# EAGLE design SolarRS485-V2.0 (EAGLE 7.4.0)
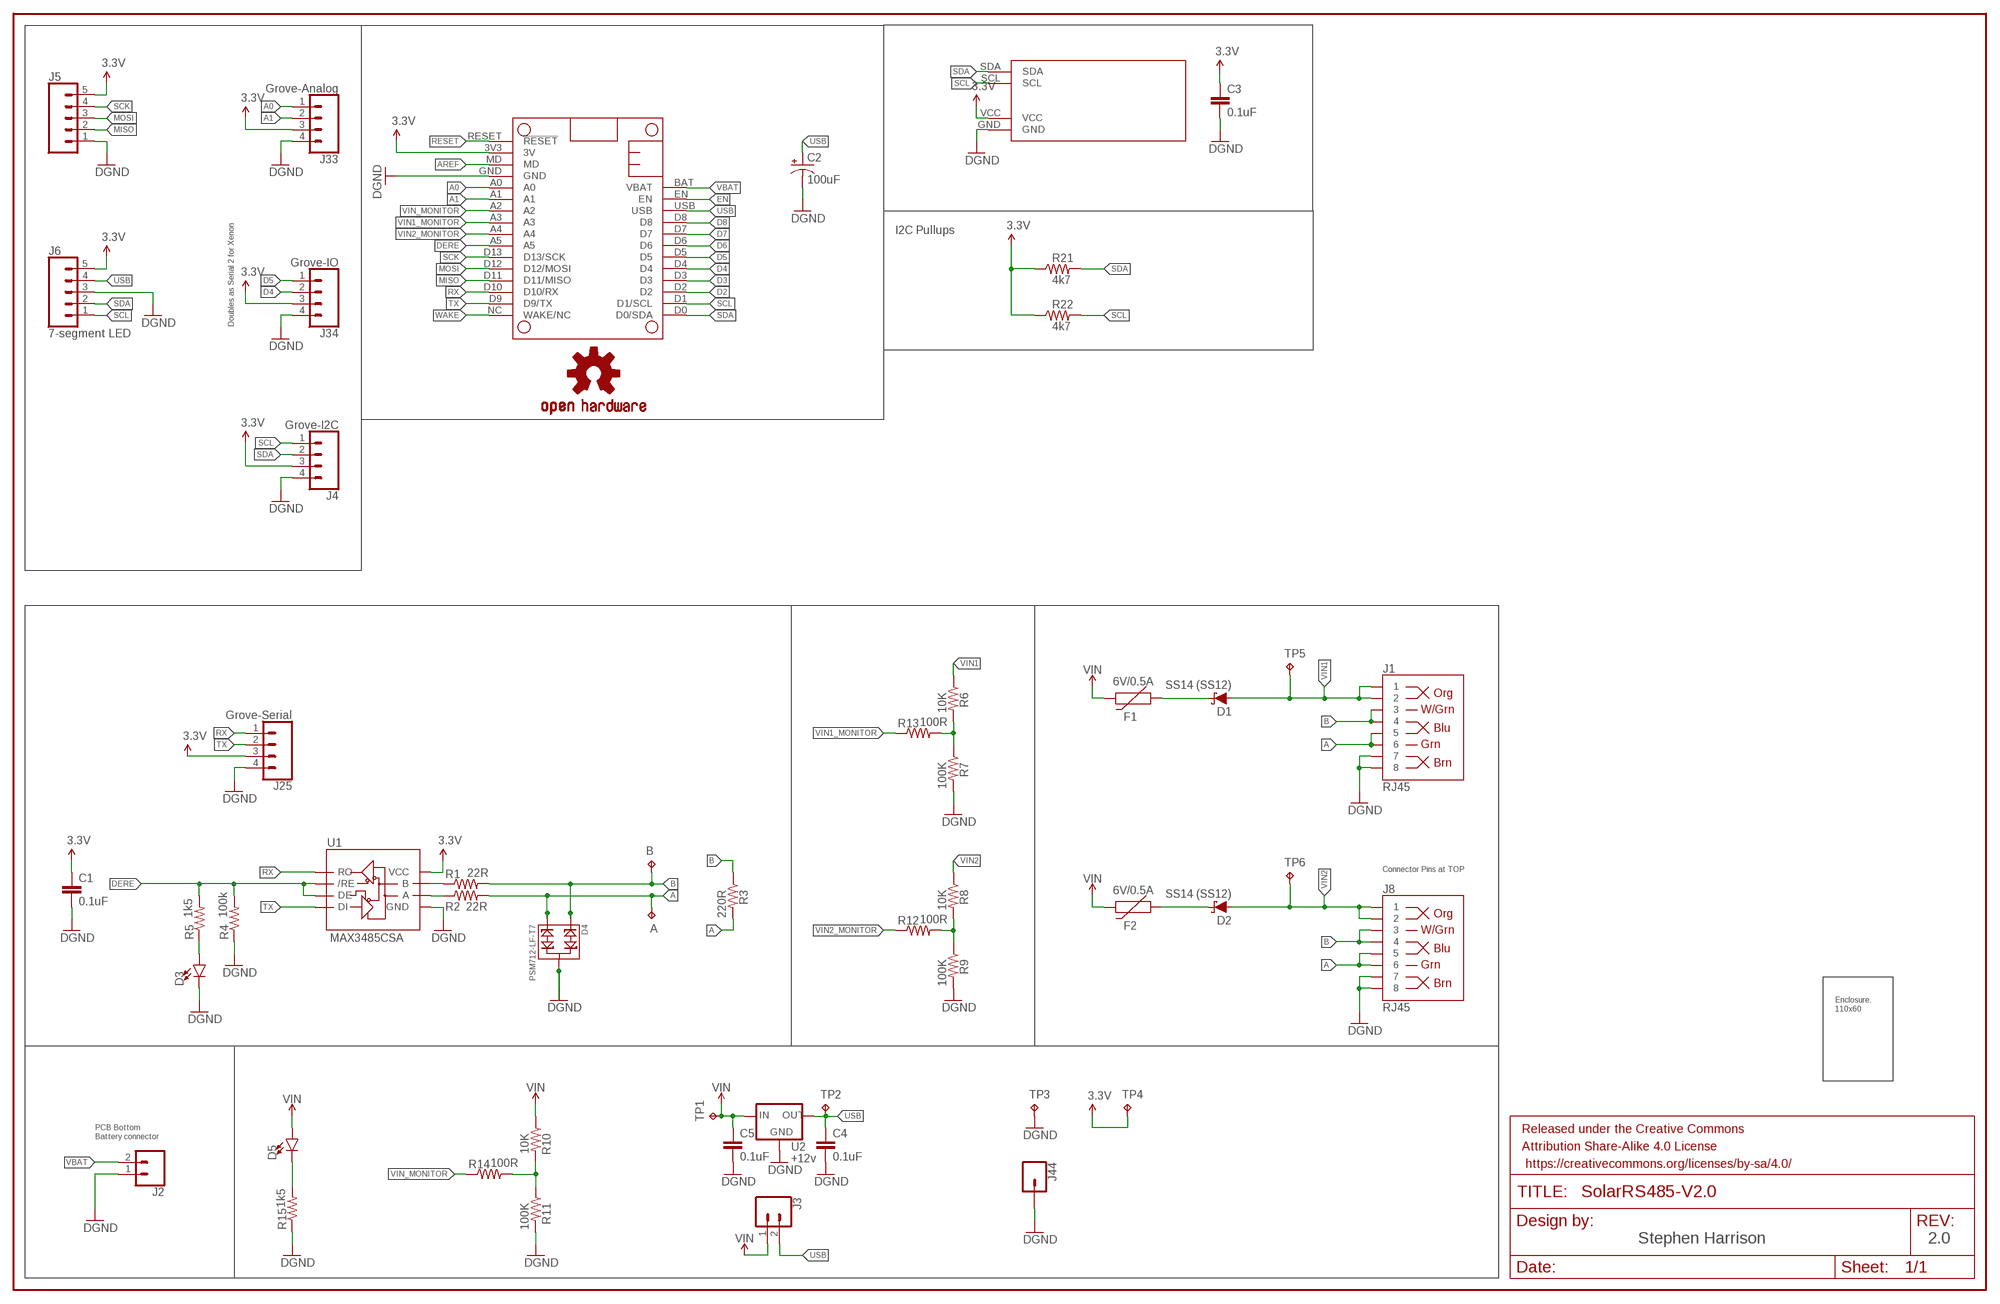
[diagram p0: schematic, sheet 1]

## Parts
A  TPTP15R  [TP15R]
B  TPTP15R  [TP15R]
C1  0.1uF  0.1UF-0805-25V  [0805]
C2  100uF  100UF-POLAR-RADIAL-2.5MM-25V-20%  [CPOL-RADIAL-2.5MM-6.5MM]
C3  0.1uF  0.1UF-0805-25V  [0805]
C4  0.1uF  0.1UF-0805-25V  [0805]
C5  0.1uF  0.1UF-0805-25V  [0805]
D1  SS14 (SS12)  DIODE-SCHOTTKY-SS14  [SMA-DIODE]
D2  SS14 (SS12)  DIODE-SCHOTTKY-SS14  [SMA-DIODE]
D3  LEDLED-1206-BOTTOM-2.0MM-BLUE  [LED-1206-BOTTOM-2.0MM]
D4  PSM712-LF-T7  SMD-DIODE-TVS-5V-225MW(SOT-23)  [SOT-23]
D5  LED1206  [LED-1206]
F1  6V/0.5A  PPTC_HALF-AMP  [1206]
F2  6V/0.5A  PPTC_HALF-AMP  [1206]
FRAME2  FRAME-LEDGER  [CREATIVE_COMMONS]
J1  RJ45  RJ45-8  [RJ45-8]
J2  CONN_02-JST-2MM-SMT  [JST-2-SMD]
J3  CONN_02  [1X02]
J4  Grove-I2C  CONN_04GROVE-JST-PH-4-2MM  [JST-4-PH-GROVE]
J5  CONN_05  [1X05]
J6  7-segment LED  CONN_05  [1X05]
J8  RJ45  RJ45-8  [RJ45-8]
J25  Grove-Serial  CONN_04GROVE-JST-PH-4-2MM  [JST-4-PH-GROVE]
J33  Grove-Analog  CONN_04GROVE-JST-PH-4-2MM  [JST-4-PH-GROVE]
J34  Grove-IO  CONN_04GROVE-JST-PH-4-2MM  [JST-4-PH-GROVE]
J44  CONN_01PTH_NO_SILK_YES_STOP  [1X01_NO_SILK]
LOGO1  OSHW-LOGOM  [OSHW-LOGO-M]
MS1  XENONA  [XENON_BREAKOUT_A]
R1  22R  RESISTOR0805  [0805]
R2  22R  RESISTOR0805  [0805]
R3  220R  RESISTOR0805  [0805]
R4  100k  RESISTOR0805  [0805]
R5  1k5  RESISTOR0805  [0805]
R6  10K  RESISTOR0805  [0805]
R7  100K  RESISTOR0805  [0805]
R8  10K  RESISTOR0805  [0805]
R9  100K  RESISTOR0805  [0805]
R10  10K  RESISTOR0805  [0805]
R11  100K  RESISTOR0805  [0805]
R12  100R  RESISTOR0805  [0805]
R13  100R  RESISTOR0805  [0805]
R14  100R  RESISTOR0805  [0805]
R15  1k5  RESISTOR0805  [0805]
R21  4k7  RESISTOR0805  [0805]
R22  4k7  RESISTOR0805  [0805]
TP1  TPTP15R  [TP15R]
TP2  TPTP15R  [TP15R]
TP3  TPTP15R  [TP15R]
TP4  TPTP15R  [TP15R]
TP5  TPTP15R  [TP15R]
TP6  TPTP15R  [TP15R]
U1  MAX3485CSA  RS485SOIC  [SO08]
U2  +12v  V_REG_78XX7812  [TO-252]
U$1  CAMDENBOSS-ENCLOSURE-110X60MAX  [CAMDENBOSS_ENCLOSRE_110X60_WIDE_EXTENDED_3]
U$2  DISPLAY0.96_INCH_DISPLAY  [I2C_DISPLAY_0.96_INCH]

## Nets
3.3V: C1.1 C3.1 J4.3 J5.5 J6.5 J25.3 J33.3 J34.3 MS1.3V3(3V) R21.1 R22.1 TP4.TP U1.8(VCC) U$2.VCC
A: A.TP D4.2 J1.5 J1.6 J8.5 J8.6 R2.2 R3.2
A0: J33.1 MS1.A0
A1: J33.2 MS1.A1
AREF: MS1.MD
B: B.TP D4.1 J1.3 J1.4 J8.3 J8.4 R1.2 R3.1
D2: MS1.D2
D3: MS1.D3
D4: J34.2 MS1.D4
D5: J34.1 MS1.D5
D6: MS1.D6
D7: MS1.D7
D8: MS1.D8
DERE: MS1.A5 R4.2 R5.2 U1.2(/RE) U1.3(DE)
EN: MS1.EN
GND: C1.2 C2.2(-) C3.2 C4.2 C5.2 D3.C D4.3 J1.7 J1.8 J2.1 J4.4 J5.1 J6.3 J8.7 J8.8 J25.4 J33.4 J34.4 J44.1 MS1.GND R4.1 R7.2 R9.2 R11.2 R15.1 TP3.TP U1.5(GND) U2.3(GND) U$2.GND ; supply symbol labelled DGND
MISO: J5.2 MS1.D11(D11/MISO)
MOSI: J5.3 MS1.D12(D12/MOSI)
N$1: R10.2 R11.1 R14.2
N$3: R6.2 R7.1 R13.2
N$4: R8.2 R9.1 R12.2
N$6: D5.C R15.2
N$7: D2.C F2.1
N$11: D1.C F1.1
N$12: R1.1 U1.7(B)
N$13: R2.1 U1.6(A)
N$21: D3.A R5.1
RESET: MS1.RESET(!RESET)
RX: J25.1 MS1.D10(D10/RX) U1.1(RO)
SCK: J5.4 MS1.D13(D13/SCK)
SCL: J4.1 J6.1 MS1.D1(D1/SCL) R22.2 U$2.SCL
SDA: J4.2 J6.2 MS1.D0(D0/SDA) R21.2 U$2.SDA
TX: J25.2 MS1.D9(D9/TX) U1.4(DI)
USB: C2.1(+) C4.1 J3.2 J6.4 MS1.USB TP2.TP U2.2(OUT)
VBAT: J2.2 MS1.BAT(VBAT)
VIN: C5.1 D5.A F1.2 F2.2 J3.1 R10.1 TP1.TP U2.1(IN)
VIN1: D1.A J1.1 J1.2 R6.1 TP5.TP
VIN1_MONITOR: MS1.A3 R13.1
VIN2: D2.A J8.1 J8.2 R8.1 TP6.TP
VIN2_MONITOR: MS1.A4 R12.1
VIN_MONITOR: MS1.A2 R14.1
WAKE: MS1.NC(WAKE/NC)

## Notes on the sheet
- I2C Pullups
- Doubles as Serial 2 for Xenon
- Connector Pins at TOP
- PCB Bottom 
  Battery connector
- Stephen Harrison | 2.0

## Library data of the parts
A B TP1-TP6 = testpad:TP: Test pad
C1 C4 C5 = ThingySticks:0.1UF: 0.1µF ceramic capacitors A capacitor is a passive two-terminal electrical component used to store electrical energy temporarily in an electric field.; LCSC: C49678
C2 = SparkFun-Capacitors:100UF-POLAR: 100µF polarized capacitors A capacitor is a passive two-terminal electrical component used to store electrical energy temporarily in an electric field.; PROD_ID: CAP-08439
C3 = ThingySticks:0.1UF: 0.1µF ceramic capacitors A capacitor is a passive two-terminal electrical component used to store electrical energy temporarily in an electric field.
D1 D2 = SparkFun-DiscreteSemi:DIODE-SCHOTTKY: Schottky diode A Schottky diode is a semiconductor diode which has a low forward voltage drop and a very fast switching action.; LCSC: C2480; PROD_ID: DIO-08053; VALUE: 1A/40V/500mV
D3 = ThingySticks:LED: LED (Generic) Standard schematic elements and footprints for 5mm, 3mm, 1206, and 0603 sized LEDs. Generic LEDs with no color specified.; COLOR: Blue; FARNELL: 2217907; FORWARD_VOLTAGE: 3.3; LCSC: DNP
D4 = OPL_Circuit_Protection:SMD-DIODE-TVS-5V-225MW(SOT-23): 304050003; LCSC: C32677; MPN: CESD5V0AP; VALUE: 5V-225MW
D5 = ThingySticks:LED: LED (Generic) Standard schematic elements and footprints for 5mm, 3mm, 1206, and 0603 sized LEDs. Generic LEDs with no color specified.
F1 = SparkFun-Fuses:PPTC: Resettable Fuse PPTC Resettable Fuse. Really a sort of resistor with a polymeric positive temperature coefficient whose resistance increases dramatically with an increase in temperature. When heated by the power passing through the resistance rises causing the current to be limited, protecting the circuit. This is achieved by the transition of the polymer from a crystalline to an amorphous state where the conductive carbon separates breaking the conductive pathways found in the cool crystalline structure. When a PPTC cools back down it resumes conducting letting the circuit turn back on. SparkFun Products: SparkFun RedBoard - Programmed with Arduino <https://www.sparkfun.com/products/12757> Pro Micro - 5V/16MHz <https://www.sparkfun.com/products/12640> Arduino Pro 328 - 5V/16MHz <https://www.sparkfun.com/products/10915> MP3 Trigger <https://www.sparkfun.com/products/13720>; LCSC: C135338; PROD_ID: RES-08585
F2 = SparkFun-Fuses:PPTC: Resettable Fuse PPTC Resettable Fuse. Really a sort of resistor with a polymeric positive temperature coefficient whose resistance increases dramatically with an increase in temperature. When heated by the power passing through the resistance rises causing the current to be limited, protecting the circuit. This is achieved by the transition of the polymer from a crystalline to an amorphous state where the conductive carbon separates breaking the conductive pathways found in the cool crystalline structure. When a PPTC cools back down it resumes conducting letting the circuit turn back on. SparkFun Products: SparkFun RedBoard - Programmed with Arduino <https://www.sparkfun.com/products/12757> Pro Micro - 5V/16MHz <https://www.sparkfun.com/products/12640> Arduino Pro 328 - 5V/16MHz <https://www.sparkfun.com/products/10915> MP3 Trigger <https://www.sparkfun.com/products/13720>; PROD_ID: RES-08585
FRAME2 = SparkFun-Aesthetics:FRAME-LEDGER: Schematic Frame Standard 11x14 US Ledger frame
J1 J8 = ThingySticks:RJ45-8: RJ45 Jack - 8 pin Simple RJ45, 8-pin connection. Commonly used for Cat5, Cat5e, and Cat6 Ethernet cables. Here is the connector we sell at SparkFun: RJ45 8-Pin Connector <https://www.sparkfun.com/products/643> (PRT-00643) Datasheet <https://cdn.sparkfun.com/datasheets/Prototyping/04908.pdf> It is used on this SparkFun product: SparkFun RJ45 Breakout <https://www.sparkfun.com/products/716> (BOB-00716) Note, you may also be interested in the "MAGJACK" version of this. It is basically a RJ45 connector, but also has some status LEDs built into the connector housing. You can check that out in this library at the device named "MAGJACK.dev" and see these products online: RJ45 Ethernet MagJack-Compatible <https://www.sparkfun.com/products/8534> (PRT-08534) SparkFun RJ45 MagJack Breakout <https://www.sparkfun.com/products/13021> (BOB-13021) Farnell: 1524544 Molex: 95501-2881; FARNELL: 1524544; MOLEX: 95501-2881; PROD_ID: CONN-08506; SF_ID: PRT-00643
J2 = ThingySticks:CONN_02: Multi connection point. Often used as Generic Header-pin footprint for 0.1 inch spaced/style header connections On any of the 0.1 inch spaced packages, you can populate with these: Break Away Headers - Straight <https://www.sparkfun.com/products/116> (PRT-00116) Break Away Male Headers - Right Angle <https://www.sparkfun.com/products/553> (PRT-00553) Female Headers <https://www.sparkfun.com/products/115> (PRT-00115) Break Away Headers - Machine Pin <https://www.sparkfun.com/products/117> (PRT-00117) Break Away Female Headers - Swiss Machine Pin <https://www.sparkfun.com/products/743> (PRT-00743) For SCREWTERMINALS and SPRING TERMINALS visit here: Screw Terimnals on SparkFun.com <https://www.sparkfun.com/search/results?term=Screw+Terminals> (5mm/3.5mm/2.54mm spacing) This device is also useful as a general connection point to wire up your design to another part of your project. Our various solder wires solder well into these plated through hole pads. Hook-Up Wire - Assortment (Stranded, 22 AWG) <https://www.sparkfun.com/products/11375> (PRT-11375) Hook-Up Wire - Assortment (Solid Core, 22 AWG) <https://www.sparkfun.com/products/11367> (PRT-11367) View the entire wire category on our website here <https://www.sparkfun.com/categories/141> Special notes: Molex polarized connector foot print use with: PRT-08233 with associated crimp pins and housings. 2.54_SCREWTERM for use with PRT-10571. 3.5mm Screw Terminal footprints for PRT-08084 5mm Screw Terminal footprints for use with PRT-08432; PROD_ID: CONN-11443
J3 = ThingySticks:CONN_02: Multi connection point. Often used as Generic Header-pin footprint for 0.1 inch spaced/style header connections On any of the 0.1 inch spaced packages, you can populate with these: Break Away Headers - Straight <https://www.sparkfun.com/products/116> (PRT-00116) Break Away Male Headers - Right Angle <https://www.sparkfun.com/products/553> (PRT-00553) Female Headers <https://www.sparkfun.com/products/115> (PRT-00115) Break Away Headers - Machine Pin <https://www.sparkfun.com/products/117> (PRT-00117) Break Away Female Headers - Swiss Machine Pin <https://www.sparkfun.com/products/743> (PRT-00743) For SCREWTERMINALS and SPRING TERMINALS visit here: Screw Terimnals on SparkFun.com <https://www.sparkfun.com/search/results?term=Screw+Terminals> (5mm/3.5mm/2.54mm spacing) This device is also useful as a general connection point to wire up your design to another part of your project. Our various solder wires solder well into these plated through hole pads. Hook-Up Wire - Assortment (Stranded, 22 AWG) <https://www.sparkfun.com/products/11375> (PRT-11375) Hook-Up Wire - Assortment (Solid Core, 22 AWG) <https://www.sparkfun.com/products/11367> (PRT-11367) View the entire wire category on our website here <https://www.sparkfun.com/categories/141> Special notes: Molex polarized connector foot print use with: PRT-08233 with associated crimp pins and housings. 2.54_SCREWTERM for use with PRT-10571. 3.5mm Screw Terminal footprints for PRT-08084 5mm Screw Terminal footprints for use with PRT-08432
J4 J25 J33 J34 = ThingySticks:CONN_04: Multi connection point. Often used as Generic Header-pin footprint for 0.1 inch spaced/style header connections On any of the 0.1 inch spaced packages, you can populate with these: Break Away Headers - Straight <https://www.sparkfun.com/products/116> (PRT-00116) Break Away Male Headers - Right Angle <https://www.sparkfun.com/products/553> (PRT-00553) Female Headers <https://www.sparkfun.com/products/115> (PRT-00115) Break Away Headers - Machine Pin <https://www.sparkfun.com/products/117> (PRT-00117) Break Away Female Headers - Swiss Machine Pin <https://www.sparkfun.com/products/743> (PRT-00743) For SCREWTERMINALS and SPRING TERMINALS visit here: Screw Terimnals on SparkFun.com <https://www.sparkfun.com/search/results?term=Screw+Terminals> (5mm/3.5mm/2.54mm spacing) This device is also useful as a general connection point to wire up your design to another part of your project. Our various solder wires solder well into these plated through hole pads. Hook-Up Wire - Assortment (Stranded, 22 AWG) <https://www.sparkfun.com/products/11375> (PRT-11375) Hook-Up Wire - Assortment (Solid Core, 22 AWG) <https://www.sparkfun.com/products/11367> (PRT-11367) View the entire wire category on our website here <https://www.sparkfun.com/categories/141> Special notes: Molex polarized connector foot print use with SKU : PRT-08231 with associated crimp pins and housings. 1MM SMD Version SKU: PRT-10208
J5 J6 = SparkFun-Connectors:CONN_05: Multi connection point. Often used as Generic Header-pin footprint for 0.1 inch spaced/style header connections On any of the 0.1 inch spaced packages, you can populate with these: Break Away Headers - Straight <https://www.sparkfun.com/products/116> (PRT-00116) Break Away Male Headers - Right Angle <https://www.sparkfun.com/products/553> (PRT-00553) Female Headers <https://www.sparkfun.com/products/115> (PRT-00115) Break Away Headers - Machine Pin <https://www.sparkfun.com/products/117> (PRT-00117) Break Away Female Headers - Swiss Machine Pin <https://www.sparkfun.com/products/743> (PRT-00743) For SCREWTERMINALS and SPRING TERMINALS visit here: Screw Terimnals on SparkFun.com <https://www.sparkfun.com/search/results?term=Screw+Terminals> (5mm/3.5mm/2.54mm spacing) This device is also useful as a general connection point to wire up your design to another part of your project. Our various solder wires solder well into these plated through hole pads. Hook-Up Wire - Assortment (Stranded, 22 AWG) <https://www.sparkfun.com/products/11375> (PRT-11375) Hook-Up Wire - Assortment (Solid Core, 22 AWG) <https://www.sparkfun.com/products/11367> (PRT-11367) View the entire wire category on our website here <https://www.sparkfun.com/categories/141> Special notes: Molex polarized connector foot print use with SKU : PRT-08231 with associated crimp pins and housings. 1MM SMD Version SKU: PRT-10208
J44 = SparkFun-Connectors:CONN_01: Single connection point. Often used as Generic Header-pin footprint for 0.1 inch spaced/style header connections On any of the 0.1 inch spaced packages, you can populate with these: Break Away Headers - Straight <https://www.sparkfun.com/products/116> (PRT-00116) Break Away Male Headers - Right Angle <https://www.sparkfun.com/products/553> (PRT-00553) Female Headers <https://www.sparkfun.com/products/115> (PRT-00115) Break Away Headers - Machine Pin <https://www.sparkfun.com/products/117> (PRT-00117) Break Away Female Headers - Swiss Machine Pin <https://www.sparkfun.com/products/743> (PRT-00743) This device is also useful as a general connection point to wire up your design to another part of your project. Our various solder wires solder well into these plated through hole pads. Hook-Up Wire - Assortment (Stranded, 22 AWG) <https://www.sparkfun.com/products/11375> (PRT-11375) Hook-Up Wire - Assortment (Solid Core, 22 AWG) <https://www.sparkfun.com/products/11367> (PRT-11367) View the entire wire category on our website here <https://www.sparkfun.com/categories/141> Special notes: SMTSO-256-ET is a "flush mount" nut for a 4-40 screw. We mostly use this on specialty testbeds; it is a nice way to connect hardware to your PCB at an adjustable hieght. Also note, the SNAP packages are for using a snappable style connector. We sell a baggie of snaps and they are also used on two LilyPad designs: Snap Assortment - 30 pack (male and female) <https://www.sparkfun.com/products/11347> (DEV-11347) LilyPad Arduino SimpleSnap <https://www.sparkfun.com/products/10941> (DEV-10941) LilyPad SimpleSnap Protoboard <https://www.sparkfun.com/products/10940> (DEV-10940)
LOGO1 = SparkFun-Aesthetics:OSHW-LOGO: Open Source Hardware Logo This logo indicates the piece of hardware it is found on incorporates a OSHW license and/or adheres to the definition of open source hardware found here: http://freedomdefined.org/OSHW
MS1 = ThingySticks:XENON
R1 R2 = SparkFun-Resistors:RESISTOR: Generic Resistor Package; LCSC: C17561
R3 = SparkFun-Resistors:RESISTOR: Generic Resistor Package; LCSC: C17557
R4 = SparkFun-Resistors:RESISTOR: Generic Resistor Package; LCSC: C17407
R5 R15 = SparkFun-Resistors:RESISTOR: Generic Resistor Package; LCSC: C4310
R6-R14 R21 R22 = SparkFun-Resistors:RESISTOR: Generic Resistor Package
U1 = SparkFun-IC-Comms:RS485: RS-485 Transceiver SP3485 Series 8 Pin NSOIC 3.3 V Low Power Half Duplex RS-485 Transceiver MAX3485 compatible Datasheet <http://www.sparkfun.com/datasheets/Components/General/sp3485CN-LTR.pdf> SparkFun Products SparkFun Transceiver Breakout - RS-485 <https://www.sparkfun.com/products/10124> (BOB-10124) SparkFun USB to RS-485 Converter <https://www.sparkfun.com/products/9822> (BOB-09822); FARNELL: 2518818; LCSC-1: C18148; LCSC-2: C9943; PROD_ID: IC-09388
U2 = SparkFun-IC-Power:V_REG_78XX: Voltage Regulator Standard 78xx regulator. IGO (Input Ground Output). Spark Fun Electronics SKU : COM-00107; PROD_ID: VREG-12370
U$1 = ThingySticks:CAMDENBOSS-ENCLOSURE-110X60: CamdenBoss Enclosure MFG: CSACTT002 Farnell: 2392777
U$2 = ThingySticks:DISPLAY

## Board
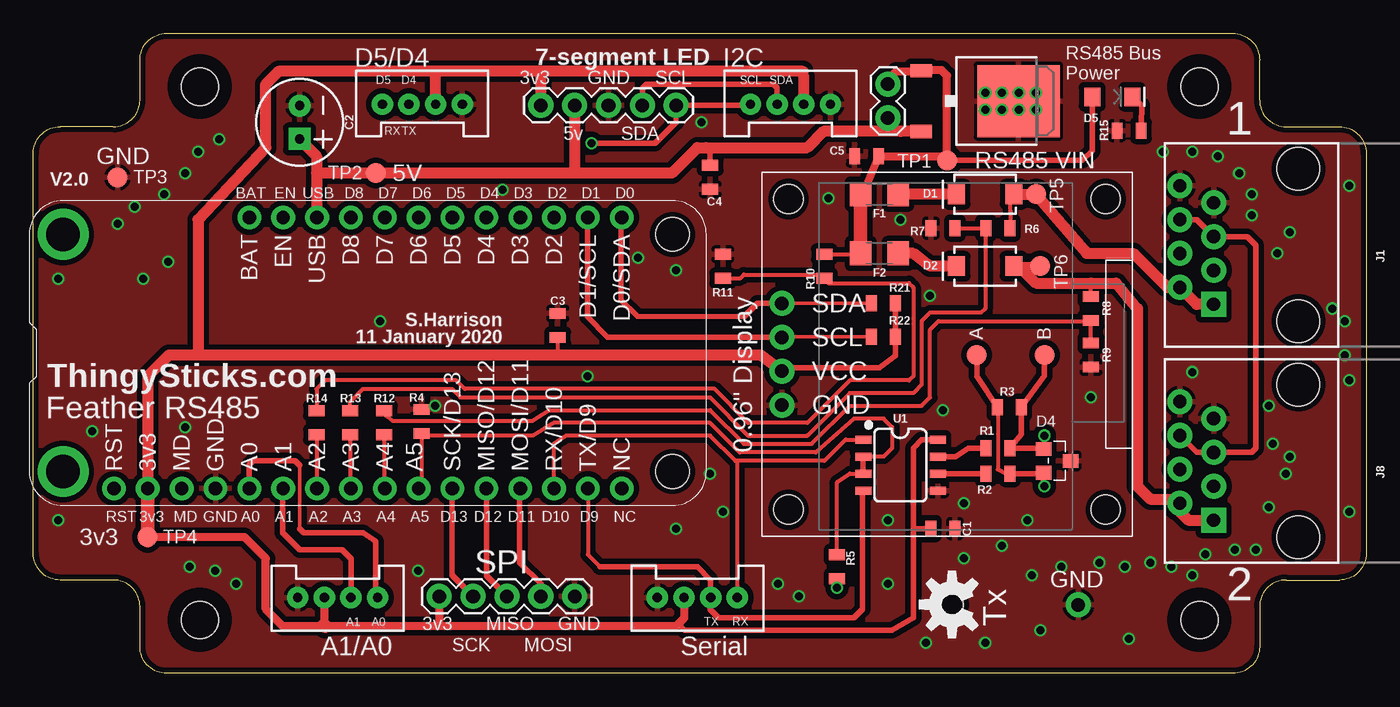
[diagram p1: board, top side]
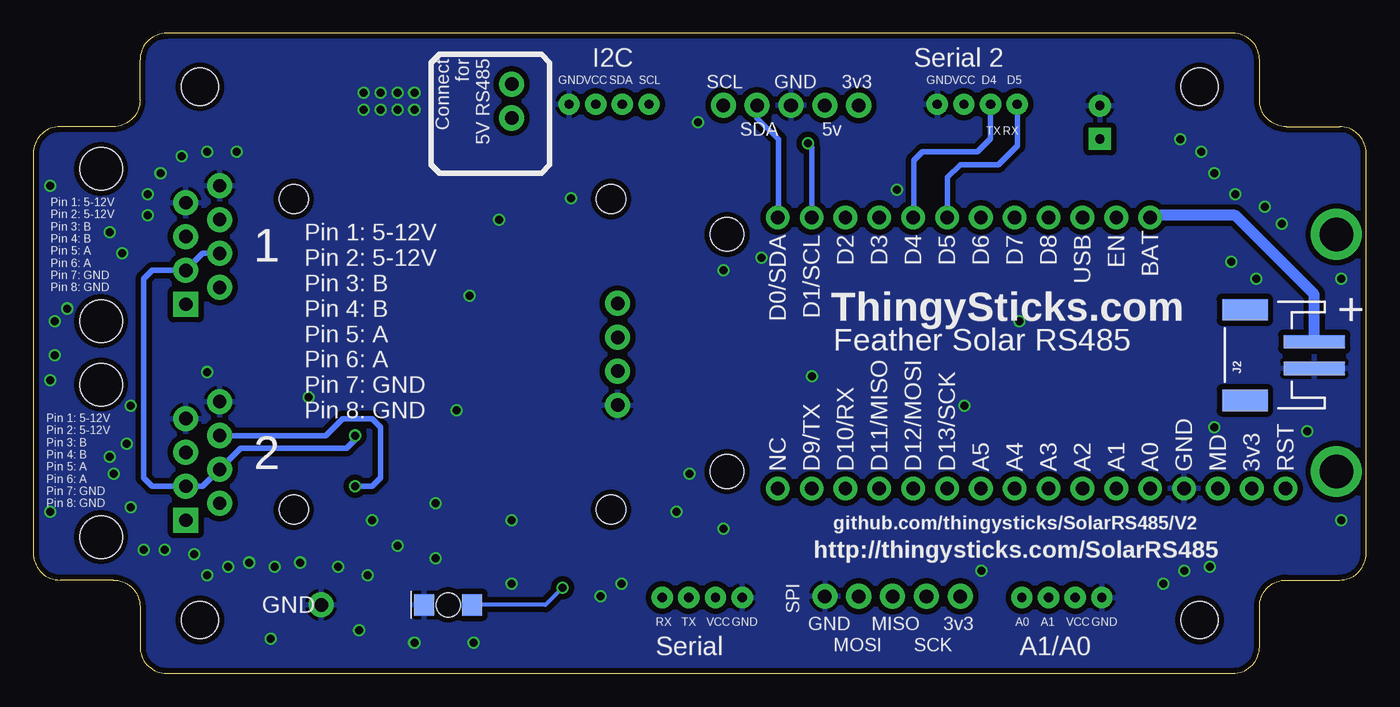
[diagram p2: board, bottom side, seen from below]

Size 100 x 48 mm. Coordinates in mm from the lower left corner, seen from the top.
Copper layers (1*16): Top 0.035mm / dielectric 1.5mm / Bottom 0.035mm
Design rules "dirt_cheap_dirty_boards.v1.1": minimum track width 6mil, minimum drill 12mil, track to track 6mil, track to pad 6mil, pad to pad 6mil, via to via 6mil, smd to smd 0mil, copper to edge 10mil, drill to drill 10mil, minimum pad ring 10mil, minimum via ring 6mil, stop-mask expansion 2mil, vias tented up to drill 25mil, thermal gap 10mil
tKeepout: area 76.5,31.6 to 84.5,39.6; area 52.8,31.6 to 60.8,39.6; area 52.7,8.4 to 60.7,16.4; area 76.6,8.4 to 84.6,16.4
tRestrict: area 10.5,42 to 14.5,46; area 10.5,2 to 14.5,6; area 85.5,2 to 89.5,6; area 85.5,42 to 89.5,46

### Footprints (pad centres in the part's own frame; a part is rotated, then mirrored left to right if it is on the bottom)
TP15R = smd 1.5 x 1.5: TP 0,0
0805 = smd 0.8 x 1.2: 1 -0.9,0; 2 0.9,0
CPOL-RADIAL-2.5MM-6.5MM = drill 0.7 pad 1.651 square: 1 1.25,0 | drill 0.7 pad 1.651: 2 -1.25,0
SMA-DIODE = smd 1.27 x 1.47: A -2.15,0; C 2.15,0
LED-1206-BOTTOM-2.0MM = smd 1.5 x 1.6: A -1.8,0; C 1.8,0 | hole 1.8: 0,0
SOT-23 = smd 1.016 x 1.143: 1 -0.889,-1.016; 2 0.889,-1.016; 3 0,1.016
LED-1206 = smd 1.2 x 1.4: A -1.5,0; C 1.5,0
1206 = smd 1.6 x 1.8: 1 -1.4,0; 2 1.4,0
RJ45-8 = drill 1 pad 1.88 square: 1 -4.445,6.35 | drill 1 pad 1.88: 2 -3.175,8.89; 3 -1.905,6.35; 4 -0.635,8.89; 5 0.635,6.35; 6 1.905,8.89; 7 3.175,6.35; 8 4.445,8.89 | hole 3.2: -5.715,0; 5.715,0
JST-2-SMD = smd 1 x 4.6: 1 -1,-3.7; 2 1,-3.7 | smd 1.6 x 3.4: NC1 -3.4,1.5; NC2 3.4,1.5
1X02 = drill 1.016 pad 1.88: 1 0,0; 2 2.54,0
JST-4-PH-GROVE = drill 0.7 pad 1.6: 1 -3,-0.55; 2 -1,-0.55; 3 1,-0.55; 4 3,-0.55
1X05 = drill 1.016 pad 1.88: 1 0,0; 2 2.54,0; 3 5.08,0; 4 7.62,0; 5 10.16,0
1X01_NO_SILK = drill 1.016 pad 1.88: 1 0,0
XENON_BREAKOUT_A = drill 1 pad 1.778: 3V3 8.89,1.27; A0 16.51,1.27; A1 19.05,1.27; A2 21.59,1.27; A3 24.13,1.27; A4 26.67,1.27; A5 29.21,1.27; BAT 16.51,21.59; D0 44.45,21.59; D1 41.91,21.59; D2 39.37,21.59; D3 36.83,21.59; D4 34.29,21.59; D5 31.75,21.59; D6 29.21,21.59; D7 26.67,21.59; D8 24.13,21.59; D9 41.91,1.27; D10 39.37,1.27; D11 36.83,1.27; D12 34.29,1.27; D13 31.75,1.27; EN 19.05,21.59; GND 13.97,1.27; MD 11.43,1.27; NC 44.45,1.27; RESET 6.35,1.27; USB 21.59,21.59 | drill 2.5 pad 3.81: P$1 2.54,20.32; P$2 2.54,2.54 | hole 2.54: 48.26,20.32; 48.26,2.54
SO08 = smd 0.6 x 1.2: 1 -1.905,-2.8; 2 -0.635,-2.8; 3 0.635,-2.8; 4 1.905,-2.8; 5 1.905,2.8; 6 0.635,2.8; 7 -0.635,2.8; 8 -1.905,2.8
TO-252 = smd 1 x 1.6: 1 -2.28,-4.8; 2 2.28,-4.8 | smd 5.4 x 6.2: 3 0,2.5
CAMDENBOSS_ENCLOSRE_110X60_WIDE_EXTENDED_3 = hole 2.8: 43,2.5; 43,77.5; 3,77.5; 3,2.5
I2C_DISPLAY_0.96_INCH = drill 1.016 pad 1.88: GND 9.84,26.3; SCL 14.92,26.3; SDA 17.46,26.3; VCC 12.38,26.3 | hole 2.2: 2,25.8; 25.3,25.8; 2,2; 25.3,2

### Placement (x,y rotation side)
A  70.78,23.87 0 top
B  75.86,23.87 0 top
C1  68.24,10.85 0 top
C2  19.98,41.33 270 top
C3  39.34,26.09 90 top
C4  50.77,37.2 270 top
C5  62.52,38.79 180 top
D1  71.41,35.93 180 top
D2  71.41,30.54 180 top
D3  68.87,5.14 180 bottom
D4  76.81,15.93 270 top
D5  80.94,43.24 0 top
F1  63.47,35.93 180 top
F2  63.47,31.49 180 top
FRAME2  16.52,-13.12 0 top  (outside the outline)
J1  94.91,32.12 90 top
J2  7.59,23.87 90 bottom
J3  64.11,44.19 270 top
J4  56.81,43.24 0 top
J5  40.61,5.77 180 top
J6  48.23,42.6 180 top
J8  94.91,15.93 90 top
J25  49.82,5.14 180 top
J33  22.83,5.14 180 top
J34  29.18,43.24 0 top
J44  78.4,5.14 0 top
LOGO1  68.93,5.16 90 top
MS1  -0.3,12.6 0 top
R1  72.36,16.89 0 top
R2  72.36,14.98 0 top
R3  73.23,19.95 180 top
R4  29.12,18.89 270 top
R5  60.3,8 90 top
R6  72.36,33.39 180 top
R7  68.24,33.39 180 top
R8  79.35,27.36 270 top
R9  79.35,23.87 270 top
R10  59.35,30.54 270 top
R11  51.73,30.54 90 top
R12  26.33,18.79 90 top
R13  23.79,18.79 90 top
R14  21.25,18.79 90 top
R15  82.21,40.7 0 top
R21  63.78,27.77 180 top
R22  63.78,25.25 180 top
TP1  68.55,38.48 0 top
TP2  25.69,37.52 0 top
TP3  6.32,37.2 0 top
TP4  8.55,10.22 0 top
TP5  75.22,35.93 0 top
TP6  75.54,30.54 0 top
U1  65.06,15.62 270 top
U2  71.41,42.92 270 top
U$1  90,1 90 top
U$2  82.46,10.28 90 top

### Tracks (layer width: path | path; a pad name or v marks a point on that pad's centre or on a via)
3.3V
  Top 0.305: C3.1 39.34,23.87
  Top 0.406: R21.1 R22.1 64.68,23.81 63.47,22.92 56.74,22.92 U$2.VCC | U1.8 66.65,17.52 66.02,16.89 66.02,10.85 | 66.02,10.85 66.02,4.18 64.43,3.23 48.87,3.23 48.39,3.71 | C1.1 66.02,10.85
  Top 0.61: 30.18,44.87 30.45,45.14 | 57.81,44.78 57.76,45.14 | J25.3 48.82,4.14 48.39,3.71 48.23,3.55 30.45,3.55 | 30.45,3.55 21.88,3.55 18.71,3.55 17.44,4.82 17.44,8.63 15.85,10.22 8.59,10.22 TP4.TP | J33.3 21.83,3.6 | J5.5 30.45,3.55
  Top 0.813: 57.76,45.14 38.07,45.14 | 38.07,45.14 30.45,45.14 18.39,45.14 17.44,44.19 17.44,39.43 12.36,34.03 12.36,23.87 | J34.3 30.18,44.87 | J4.3 57.81,44.78 | U$2.VCC 54.58,23.87 39.34,23.87 12.36,23.87 | 12.36,23.87 10.17,23.87 8.59,22.28 MS1.3V3 | J6.5 38.07,45.14
  Top 1.016: MS1.3V3 8.59,10.22 8.59,9.94 | 21.83,3.6 21.88,3.55
  Bottom 0.61: 56.22,22.6 U$2.VCC
A  (via drill 0.6)
  Top 0.305: 72.33,19.78 72.36,19.74 72.36,15.3 73,14.98
  Top 0.406: 73,14.98 R2.2 75.41,14.98 D4.2 75.79,14.09 v75.86,14.03 | 72.33,19.78 R3.2 70.78,22.28 A.TP | J1.6 87.29,34.03 J1.5 91.1,32.76 91.73,32.12 91.73,16.89 91.41,16.57 J8.5 87.29,16.57 J8.6
  Bottom 0.406: v75.86,14.03 74.59,14.03 73.95,14.66 73.95,18.47 74.59,19.11 76.81,19.11 78.08,17.84 J8.6
A0
  Top 0.254: 19.98,15.62 19.98,10.85
  Top 0.406: MS1.A0 16.21,15.65 16.48,15.93 19.66,15.93 19.98,15.62 | 19.98,10.85 20.29,10.54 24.74,10.54 25.69,9.9 25.69,5.19 J33.1
A1
  Top 0.406: J33.2 23.83,8.58 23.15,9.27 19.98,9.27 18.71,10.54 18.71,13.83 MS1.A1
B  (via drill 0.6)
  Top 0.305: 76.17,17.2 D4.1
  Top 0.406: B.TP 75.86,22.31 R3.1 74.13,17.93 R1.2 75.41,16.89 D4.1 75.86,16.89 v75.86,17.84
  Bottom 0.406: v75.86,17.84 75.86,17.52 76.49,16.89 84.43,16.89 J8.4 87.29,14.03 J8.3 91.1,14.03 91.73,14.66 91.73,29.59 91.1,30.22 J1.3 87.29,31.49 J1.4
D4
  Bottom 0.406: J34.2 28.18,40.11 29.18,39.11 33.31,39.11 33.95,38.48 33.95,34.23 MS1.D4
D5
  Bottom 0.406: J34.1 26.18,39.57 27.6,38.16 30.45,38.16 31.41,37.2 31.41,34.23 MS1.D5
DERE
  Top 0.305: MS1.A5 29.12,14.09 R4.2 29.28,17.84 37.44,17.84 39.03,18.79 50.77,18.79 53,16.57 58.71,16.57 61.57,19.11 63.79,19.11 64.43,18.47 64.43,16.89 63.79,16.25 U1.2 | R5.2 60.3,14.35 61.25,14.98 U1.3
  Top 0.406: U1.3 U1.2
GND  (via drill 0.6)
  other vias: 68.24,19.74 72.68,9.58 1.88,11.49 51.73,12.12 91.41,34.35 91.41,35.93 90.46,37.52 86.97,22.6 98.4,23.87 91.73,9.27 86.97,7.36 82.21,2.6 28.87,7.68 59.66,35.62 65.06,34.03 50.14,41.33 75.22,42.28 75.22,43.55 73.95,42.28 73.95,43.55 72.68,43.55 71.41,43.55 72.68,42.28 71.41,42.28 50.77,14.98 30.14,20.06 67.28,28.32 48.23,30.22 79.35,20.7 74.59,11.49 69.82,8.63 69.82,12.76 64.11,11.49 66.97,2.28 64.11,6.72 57.44,5.77 55.85,6.72 71.41,2.28 75.54,3.23 26.01,26.41 41.57,22.28 45.38,31.17 35.22,36.25 8.23,29.59 10.13,30.86 1.88,29.59 6.32,33.71 7.59,34.98 9.82,35.93 11.4,37.52 12.36,39.11 13.94,40.06 11.72,8 13.63,7.68 15.21,6.72 4.42,18.16 11.4,18.47 48.23,10.85 94.27,33.08 93.32,31.49 97.45,27.36 98.4,26.41 92.68,20.06 98.72,21.96 93,17.2 94.27,16.25 93.95,14.98 92.68,12.44 98.72,12.12 98.72,36.57 88.88,38.79 86.97,39.11 84.75,39.11 87.92,8.95 90.14,9.27 85.38,8 83.79,8.31 81.89,8 79.98,8.31 77.13,8 74.91,7.36
  pour Bottom (isolate 0.406, rank 5): -0.66,48.63 100.62,48 100.62,-0.26 -0.66,-0.26
  pour Top (isolate 0.406, rank 5): -0.66,48.63 99.99,48 100.62,-0.26 -0.66,-0.58
MISO
  Top 0.406: J5.2 38.07,6.72 36.49,8.31 36.49,13.83 MS1.D11
MOSI
  Top 0.406: MS1.D12 33.99,7.32 J5.3
N$1
  Top 0.305: 21.19,19.74 R14.2 21.25,21.33 21.88,21.96 31.72,21.96 32.36,21.33 51.09,21.33 53.63,18.79 58.08,18.79 61.25,21.96 65.7,21.96 66.02,22.28 66.02,28.95 65.7,29.27 59.66,29.27 59.35,29.59 | R11.1 53.05,29.64 53.31,29.9 59.08,29.9 R10.2
  Top 0.406: R14.2 21.19,19.69 | 59.35,29.53 59.35,29.59 R10.2
N$3
  Top 0.305: R13.2 23.79,20.38 24.74,21.33 31.41,21.33 32.04,20.7 50.77,20.7 53.63,17.84 58.08,17.84 61.25,21.01 66.02,21.01 66.65,21.65 66.65,26.41 67.28,27.05 71.09,27.05 71.41,27.36 71.41,33.08 R6.2 R7.1
N$4
  Top 0.305: R9.1 R8.2 79.3,26.41 67.92,26.41 67.28,25.78 67.28,20.7 66.65,20.06 61.25,20.06 58.39,17.2 53.31,17.2 50.77,19.74 38.71,19.74 37.44,18.94 26.97,18.94 26.33,19.43 R12.2
N$6
  Top 0.406: D5.C 83.16,42.6 83.16,42.28 R15.2
N$7
  Top 0.813: D2.C 67.28,30.54 66.02,31.49 F2.1
N$11
  Top 0.813: D1.C F1.1
N$12
  Top 0.406: U1.7 69.19,16.25 70.14,16.89 R1.1
N$13
  Top 0.406: U1.6 R2.1
N$21  (via drill 0.6)
  Top 0.305: R5.1 v60.3,6.41
  Bottom 0.305: v60.3,6.41 61.57,5.14 D3.A
RX
  Top 0.305: 52.68,15.93 59.35,15.93 60.93,17.52 U1.1 | 52.68,15.93 50.77,17.84 39.98,17.84 39.03,17.2 39.03,13.91 MS1.D10 | J25.1 52.82,15.79 52.68,15.93
  Top 0.406: 39.03,13.83 MS1.D10
SCK
  Top 0.406: J5.4 31.41,7.36 31.41,13.83 MS1.D13
SCL  (via drill 0.6)
  Top 0.254: R22.2 56.21,25.25 U$2.SCL
  Top 0.406: U$2.SCL 43.09,25.2 41.57,26.73 41.57,34.15 MS1.D1 | v41.88,39.74 46.65,39.74 48.23,41.33 J6.1 53.72,42.6 J4.1
  Bottom 0.406: v41.88,39.74 41.57,39.43 41.57,34.23 MS1.D1
SDA
  Top 0.254: R21.2 56.19,27.77 U$2.SDA
  Top 0.406: MS1.D0 44.11,34.15 44.11,28 45.32,26.79 53.31,26.73 54.33,27.74 U$2.SDA | J4.2 55.81,43.92 55.54,44.19 46.01,44.19 45.69,43.87 J6.2
  Bottom 0.406: J6.2 45.69,41.65 44.11,40.06 44.11,34.23 MS1.D0
TX
  Top 0.305: MS1.D9 41.61,8.91 42.52,8
  Top 0.406: U1.4 62.2,13.39 62.2,4.82 61.57,4.18 51.41,4.18 50.77,4.82 50.77,5 J25.2 50.82,7 49.82,8 42.52,8
USB
  Top 0.406: C4.1 50.77,39.11 50.46,39.43
  Top 0.61: 63.84,40.69 64.08,40.68 | 64.08,40.68 65.06,40.64 | 40.61,37.84 40.93,37.52 | J3.2 64.11,40.71 64.08,40.68
  Top 0.813: C2.1 19.98,40.06 21.25,38.79 21.25,37.52 | 21.25,37.52 21.25,34.23 | 21.25,37.52 TP2.TP 40.93,37.52 47.92,37.52 49.82,39.43 50.46,39.43 58.08,39.43 59.29,40.64 65.06,40.64 U2.2 | J6.4 40.61,37.84
  Top 1.016: 21.25,34.23 MS1.USB 21.25,34.15
  Bottom 0.61: 20,40.06 C2.1
VBAT
  Bottom 0.813: J2.2 3.89,28.43 9.82,34.35 16.05,34.35 MS1.BAT
VIN
  Top 0.305: R10.1 62.02,31.44 F2.2
  Top 0.406: D5.A 79.44,39.2 78.71,38.48 TP1.TP
  Top 0.61: F1.2 62.52,36.38 62.52,36.57 62.47,36.52 C5.1 68.24,38.79 TP1.TP 68.55,44.82 68.14,45.24 66.65,45.24 U2.1 66.55,45.14 64.74,45.14 64.11,44.51 J3.1
  Top 1.016: F2.2 F1.2
VIN1
  Top 0.305: D1.A 73.63,35.37 73.32,35.3 73.32,34.66 R6.1
  Top 0.813: D1.A TP5.TP 79.03,31.49 82.52,31.49 85.06,28.95 J1.2 87.29,27.68 J1.1
VIN1_MONITOR
  Top 0.305: R13.1 23.79,13.91 MS1.A3
VIN2
  Top 0.305: R8.1 79.35,29.27
  Top 0.61: TP6.TP D2.A
  Top 0.813: D2.A 73.88,30.61 75.22,29.27 79.35,29.27 81.25,29.27 82.84,27.36 82.84,14.03 83.79,13.07 85.7,13.07 J8.2 86.02,12.12 86.65,11.49 J8.1
VIN2_MONITOR
  Top 0.305: R12.1 26.33,13.91 MS1.A4
VIN_MONITOR
  Top 0.305: R14.1 21.25,13.91 MS1.A2

### Text on the board
tNames: D5/D4 | I2C | D5 | D4 | 3v3 | GND | SCL | SCL | SDA | RS485 Bus / Power | 5v | SDA | RX | TX | 1 | RS485 VIN | GND | V2.0 | 5V | S.Harrison | SDA | 11 January 2020 | SCL | VCC | ThingySticks.com | Feather RS485 | GND | 0.96" Display | 3v3 | SPI | GND | 2 | A1 | A0 | TX | RX | Tx | 3v3 | MISO | GND | SCK | MOSI | A1/A0 | Serial
bNames: Connect / for / 5V RS485 | Serial 2 | I2C | D5 | D4 | VCC | GND | 3v3 | GND | SCL | SCL | SDA | VCC | GND | 5v | SDA | RX | TX | 1 | Pin 1: 5-12V / Pin 2: 5-12V / Pin 3: B / Pin 4: B / Pin 5: A / Pin 6: A / Pin 7: GND / Pin 8: GND | + | ThingySticks.com | Feather Solar RS485 | Pin 1: 5-12V / Pin 2: 5-12V / Pin 3: B / Pin 4: B / Pin 5: A / Pin 6: A / Pin 7: GND / Pin 8: GND | 2 | github.com/thingysticks/SolarRS485/V2 | Pin 1: 5-12V / Pin 2: 5-12V / Pin 3: B / Pin 4: B / Pin 5: A / Pin 6: A / Pin 7: GND / Pin 8: GND | http://thingysticks.com/SolarRS485 | GND | VCC | A1 | A0 | SPI | GND | VCC | TX | RX | GND | 3v3 | MISO | GND | SCK | MOSI | A1/A0 | Serial